# Altium schematic sheet 主控PCB原理图.SchDoc
size A4
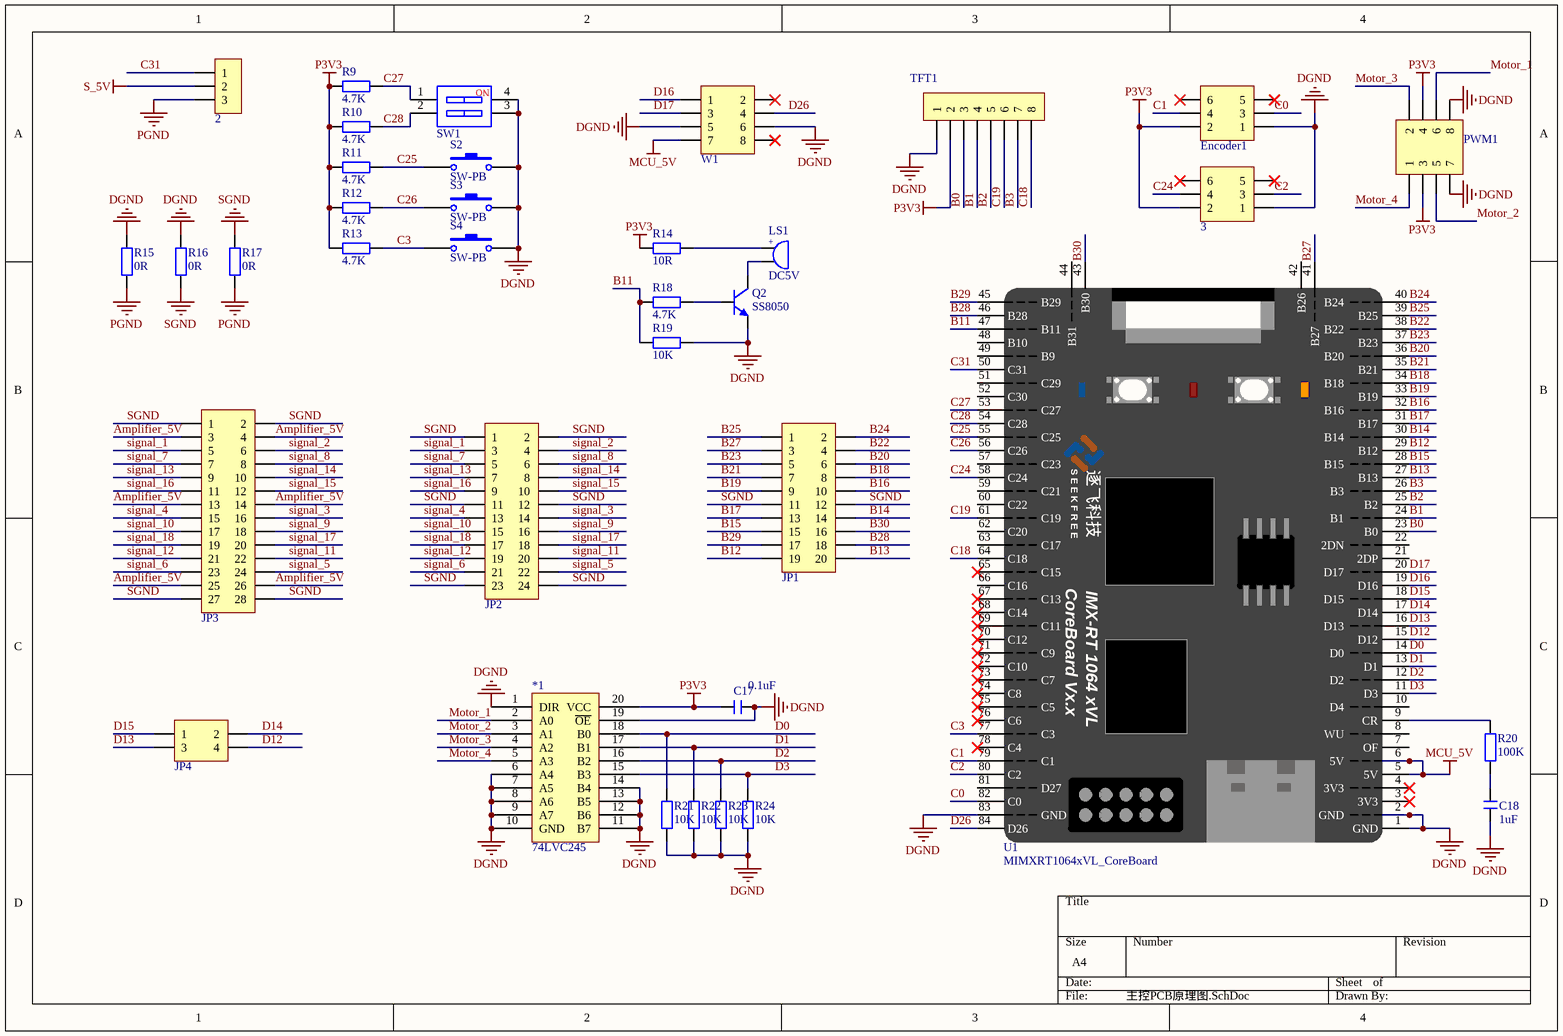
[diagram p0: 主控PCB原理图.SchDoc]

## Parts
2  HDR-1X3  [HDR2.54-LI-3P]  (value not drawn)
3  Header3X2  [HDR2.54-LI-2x3P]  (value not drawn)
*1  74LVC245  [TSSOP20_M]
C17  0.1uF  [C 0603_L]
C18  1uF  [C 0603_L]
Encoder1  Header3X2  [HDR2.54-LI-2x3P]  (value not drawn)
JP1  Header 2X10  [HDR2.54-M-LS-2x10P]  (value not drawn)
JP2  Header 2X11  [HDR2.54-LI-2x12P]  (value not drawn)
JP3  Header 2X11  [HDR2.54-M-LS-2x14P]  (value not drawn)
JP4  Header2X2  [HDR2.54-LI-2x2P]  (value not drawn)
LS1  DC5V  [BEEP 7.6X12X9.5]
PWM1  Header 4X2  [HDR2.54-LI-2x4P]  (value not drawn)
Q2  SS8050  [SOT23-3N]
R9  4.7K  [R 0603_L]
R10  4.7K  [R 0603_L]
R11  4.7K  [R 0603_L]
R12  4.7K  [R 0603_L]
R13  4.7K  [R 0603_L]
R14  10R  [R 0603_L]
R15  0R  [R 0603_L]
R16  0R  [R 0603_L]
R17  0R  [R 0603_L]
R18  4.7K  [R 0603_L]
R19  10K  [R 0603_L]
R20  100K  [R 0603_L]
R21  10K  [R 0603_L]
R22  10K  [R 0603_L]
R23  10K  [R 0603_L]
R24  10K  [R 0603_L]
S2  SW-PB  [TSW SMD-3*6*4.3]
S3  SW-PB  [TSW SMD-3*6*4.3]
S4  SW-PB  [TSW SMD-3*6*4.3]
SW1  SW-2P  [CSW DIP-2P_G]  (value not drawn)
TFT1  HDR-1X8  [HDR2.54-LI-8P]  (value not drawn)
U1  MIMXRT1064xVL_CoreBoard  [MIMXRT1064xVL_CoreBoard]
W1  Header 4X2  [HDR2.54-M-LS-2x4P]  (value not drawn)

## Nets
DGND: 3.1 *1.1(DIR) *1.6(A4) *1.7(A5) *1.8(A6) *1.9(A7) *1.10(GND) *1.11(B7) *1.12(B6) *1.13(B5) *1.14(B4) *1.19(~{OE}) C17.2 C18.1 Encoder1.1 PWM1.7 PWM1.8 Q2.2(E) R15.2 R16.2 R19.2 R21.1 R22.1 R23.1 R24.1 S2.2 S3.2 S4.2 SW1.3 SW1.4 TFT1.1 U1.1(GND) U1.2(GND) U1.83(GND) W1.5 W1.6
MCU_5V: U1.5(5V) U1.6(5V) W1.7
P3V3: 3.2 *1.20(VCC) C17.1 Encoder1.2 PWM1.3 PWM1.4 R9.1 R10.1 R11.1 R12.1 R13.1 R14.1 TFT1.2
PGND: 2.3 R15.1 R17.1
S_5V: 2.2
SGND: JP1.11 JP1.12 JP2.1 JP2.2 JP2.11 JP2.12 JP2.23 JP2.24 JP3.1 JP3.2 JP3.27 JP3.28 R16.1 R17.2
Amplifier_5V: JP3.3 JP3.4 JP3.13 JP3.14 JP3.25 JP3.26
B0: TFT1.3 U1.23(B0)
B1: TFT1.4 U1.24(B1)
B2: TFT1.5 U1.25(B2)
B3: TFT1.7 U1.26(B3)
B11: R18.1 R19.1 U1.47(B11)
B12: JP1.19 U1.29(B12)
B13: JP1.20 U1.27(B13)
B14: JP1.14 U1.30(B14)
B15: JP1.15 U1.28(B15)
B16: JP1.10 U1.32(B16)
B17: JP1.13 U1.31(B17)
B18: JP1.8 U1.34(B18)
B19: JP1.9 U1.33(B19)
B20: JP1.6 U1.36(B20)
B21: JP1.7 U1.35(B21)
B22: JP1.4 U1.38(B22)
B23: JP1.5 U1.37(B23)
B24: JP1.2 U1.40(B24)
B25: JP1.1 U1.39(B25)
B27: JP1.3 U1.41(B27)
B28: JP1.18 U1.46(B28)
B29: JP1.17 U1.45(B29)
B30: JP1.16 U1.43(B30)
C0: Encoder1.3 U1.82(C0)
C1: Encoder1.4 U1.79(C1)
C2: 3.3 U1.80(C2)
C3: R13.2 S4.1 U1.77(C3)
C18: TFT1.8 U1.64(C18)
C19: TFT1.6 U1.61(C19)
C24: 3.4 U1.58(C24)
C25: R11.2 S2.1 U1.55(C25)
C26: R12.2 S3.1 U1.56(C26)
C27: R9.2 SW1.1 U1.53(C27)
C28: R10.2 SW1.2 U1.54(C28)
C31: 2.1 U1.50(C31)
D0: *1.18(B0) R21.2 U1.14(D0)
D1: *1.17(B1) R22.2 U1.13(D1)
D2: *1.16(B2) R23.2 U1.12(D2)
D3: *1.15(B3) R24.2 U1.11(D3)
D12: JP4.4 U1.15(D12)
D13: JP4.3 U1.16(D13)
D14: JP4.2 U1.17(D14)
D15: JP4.1 U1.18(D15)
D16: U1.19(D16) W1.1
D17: U1.20(D17) W1.3
D26: U1.84(D26) W1.4
Motor_1: *1.2(A0) PWM1.6
Motor_2: *1.3(A1) PWM1.5
Motor_3: *1.4(A2) PWM1.2
Motor_4: *1.5(A3) PWM1.1
signal_1: JP2.3 JP3.5
signal_2: JP2.4 JP3.6
signal_3: JP2.14 JP3.16
signal_4: JP2.13 JP3.15
signal_5: JP2.22 JP3.24
signal_6: JP2.21 JP3.23
signal_7: JP2.5 JP3.7
signal_8: JP2.6 JP3.8
signal_9: JP2.16 JP3.18
signal_10: JP2.15 JP3.17
signal_11: JP2.20 JP3.22
signal_12: JP2.19 JP3.21
signal_13: JP2.7 JP3.9
signal_14: JP2.8 JP3.10
signal_15: JP2.10 JP3.12
signal_16: JP2.9 JP3.11
signal_17: JP2.18 JP3.20
signal_18: JP2.17 JP3.19
NetC18_2: C18.2 R20.1
NetLS1_1: LS1.1 R14.2
NetLS1_2: LS1.2 Q2.3(C)
NetQ2_1: Q2.1(B) R18.2
NetR20_2: R20.2 U1.9(CR)

Not connected (* = marked no-connect by the designer): 3 5* 6*; Encoder1 5* 6*; U1 3(3V3)* 4(3V3)* 7(OF) 8(WU) 10(D4) 21(2DP) 22(2DN) 42(B26) 44(B31) 48(B10) 49(B9) 51(C29) 52(C30) 57(C23) 59(C21) 60(C22) 62(C20) 63(C17) 65(C15)* 66(C16) 67(C13)* 68(C14)* 69(C11)* 70(C12)* 71(C9)* 72(C10)* 73(C7)* 74(C8)* 75(C5)* 76(C6)* 78(C4)* 81(D27); W1 2* 8*

## Notes on the sheet
- (in symbol BEEP) +
- (in symbol MIMXRT1064xVL_CoreBoard) S E E K F R E E; 逐飞科技; CoreBoard Vx.x; IMX-RT 1064 xVL
- (in symbol SW-2P) NO

## Library data of the parts
2 = Header 3: 3P接插件; 封装库来自淘宝卖家  ID：黄晶宝石: 其他店铺购入均为盗版假冒封装库，请立即申请退款; 技术支持， 联系售后: 唯一出售店铺网址https://shop463601444.taobao.com; BOM名称: 3P接插件
3 Encoder1 = Header 3X2: 3*2P接插件; 封装库来自淘宝卖家  ID：黄晶宝石: 其他店铺购入均为盗版假冒封装库，请立即申请退款; 技术支持， 联系售后: 唯一出售店铺网址https://shop463601444.taobao.com; BOM名称: 3*2P接插件
C17 C18 = C: 贴片电容; BOM名称: 无极性贴片电容; 封装库来自淘宝卖家 ID：黄晶宝石: 其他店铺购入均为盗版假冒封装库; 联系卖家，免费查找封装: 唯一出售店铺网址https://shop463601444.taobao.com
JP1 = Header 10X2: 10*2P接插件; 封装库来自淘宝卖家  ID：黄晶宝石: 其他店铺购入均为盗版假冒封装库，请立即申请退款; 技术支持， 联系售后: 唯一出售店铺网址https://shop463601444.taobao.com; BOM名称: 10*2P接插件
JP2 = Header 12X2: 12*2P接插件; 封装库来自淘宝卖家  ID：黄晶宝石: 其他店铺购入均为盗版假冒封装库，请立即申请退款; 技术支持， 联系售后: 唯一出售店铺网址https://shop463601444.taobao.com; BOM名称: 12*2P接插件
JP3 = Header 14X2: 14*2P接插件; 封装库来自淘宝卖家  ID：黄晶宝石: 其他店铺购入均为盗版假冒封装库，请立即申请退款; 技术支持， 联系售后: 唯一出售店铺网址https://shop463601444.taobao.com; BOM名称: 14*2P接插件
JP4 = Header 2X2: 2*2P接插件; 封装库来自淘宝卖家  ID：黄晶宝石: 其他店铺购入均为盗版假冒封装库，请立即申请退款; 技术支持， 联系售后: 唯一出售店铺网址https://shop463601444.taobao.com; BOM名称: 2*2P接插件
LS1 = BEEP: 蜂鸣器; 封装库来自淘宝卖家 ID：黄晶宝石: 其他店铺购入均为盗版，请立即申请退款，本店提供现金奖励; 免费技术支持，联系售后: 唯一出售店铺网址https://shop463601444.taobao.com; BOM名称: 蜂鸣器
PWM1 W1 = Header 4X2: 4*2P接插件; 封装库来自淘宝卖家  ID：黄晶宝石: 其他店铺购入均为盗版假冒封装库，请立即申请退款; 技术支持， 联系售后: 唯一出售店铺网址https://shop463601444.taobao.com; BOM名称: 4*2P接插件
Q2 = 8050-SMD: 高频放大-NPN型; 封装库来自淘宝卖家 ID：黄晶宝石: 其他店铺购入均为假冒，请立即申请退款，本店奖励2~5元现金; B属性: 40V 1.5A 1W 100MHZ; 卖家免费查找封装，联系售后: 唯一出售店铺网址https://shop463601444.taobao.com; BOM名称: 高频放大-NPN型
R9-R24 = R: 贴片电阻; 封装库来自淘宝卖家 ID：黄晶宝石: 其他店铺购入均为盗版假冒封装库; 联系卖家，免费查找封装: 唯一出售店铺网址https://shop463601444.taobao.com; BOM名称: 贴片电阻
S2-S4 = SW-PB: 微动开关; 免费技术支持，联系售后: 唯一出售店铺网址https://shop463601444.taobao.com; 封装库来自淘宝卖家 ID：黄晶宝石: 其他店铺购入均为盗版假冒封装库，请立即申请退款，本店3~10元现金奖励
SW1 = SW-2P: 2路编码开关; 免费技术支持，联系售后: 唯一出售店铺网址https://shop463601444.taobao.com; 封装库来自淘宝卖家 ID：黄晶宝石: 其他店铺购入均为盗版假冒封装库，请立即申请退款，本店3~10元现金奖励; BOM名称: 2路编码开关
TFT1 = Header 8: 8P接插件; 封装库来自淘宝卖家  ID：黄晶宝石: 其他店铺购入均为盗版假冒封装库，请立即申请退款; 技术支持， 联系售后: 唯一出售店铺网址https://shop463601444.taobao.com; BOM名称: 8P接插件
U1 = MIMXRT1064xVL_CoreBoard: 逐飞科技i.MX RT1064核心板整体原理，可直接使用